# Altium schematic sheet main.SchDoc
size A4
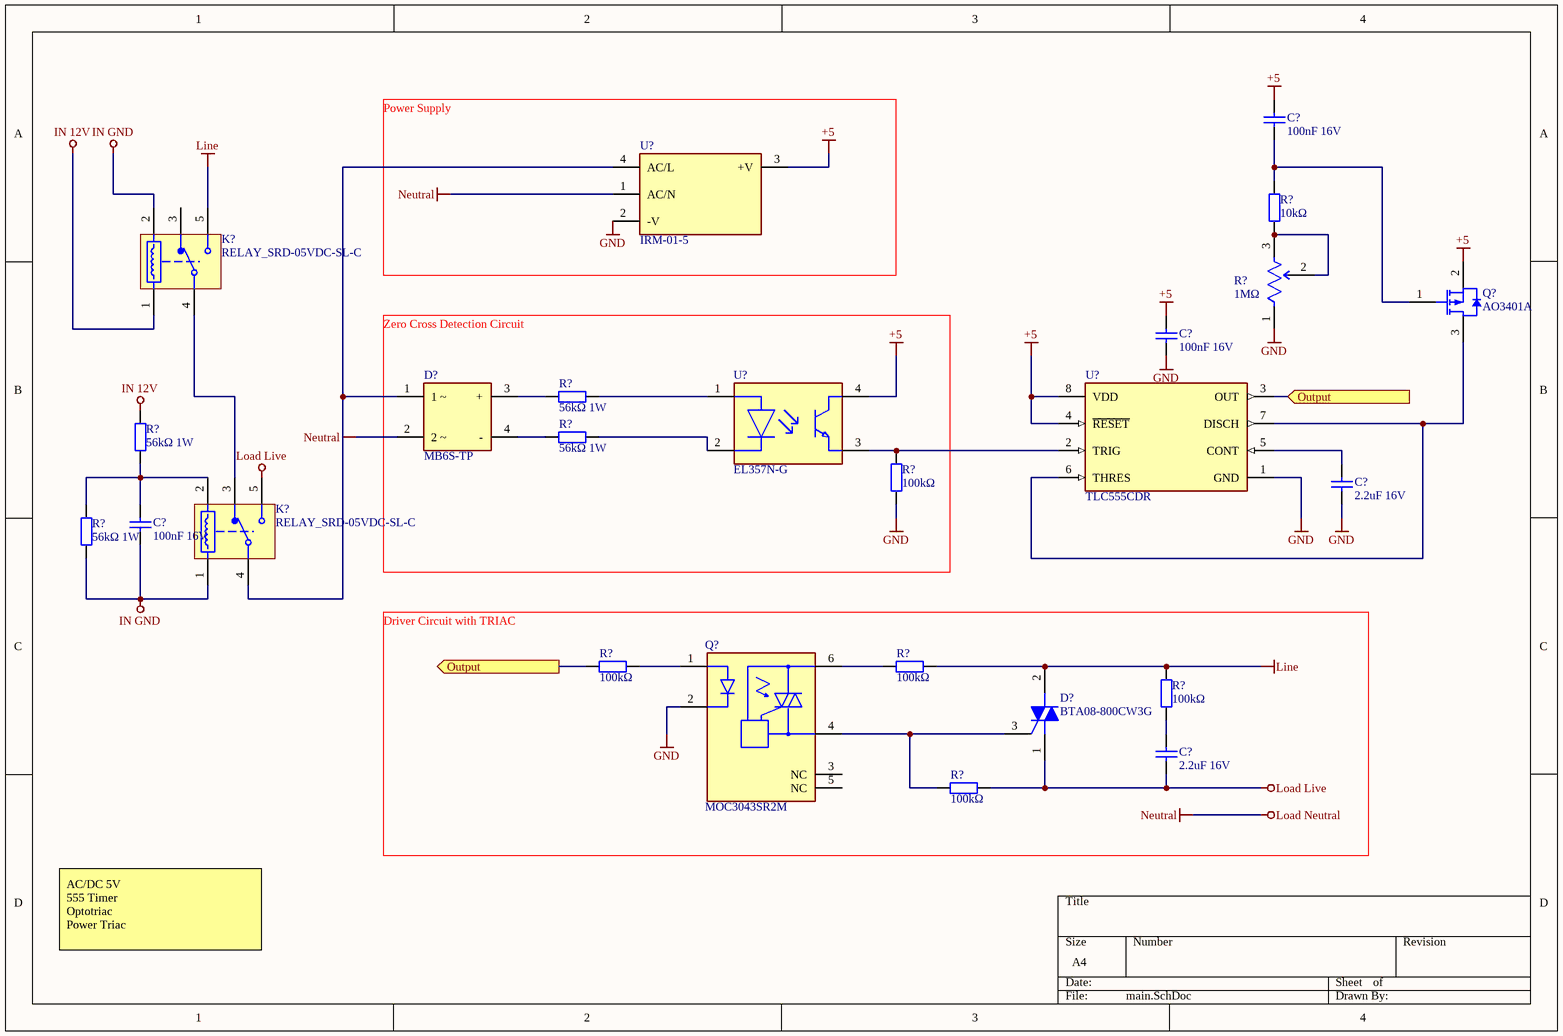
[diagram p0: main.SchDoc]

## Parts
(Parts that share a designator on the sheet are numbered #1, #2 ... from top to bottom, then left to right.)
C?#1  100nF 16V  [CAP_0805]
C?#2  100nF 16V  [CAP_0805]
C?#3  2.2uF 16V  [CAP_0805]
C?#4  100nF 16V  [CAP_0805]
C?#5  2.2uF 16V  [CAP_0805]
D?#1  MB6S-TP  [FP-MBS-1-MFG]
D?#2  BTA08-800CW3G  [ONSC-TO-220-3-221A-07]
K?#1  RELAY_SRD-05VDC-SL-C  [SRD-05-VDC-SL-C]
K?#2  RELAY_SRD-05VDC-SL-C  [SRD-05-VDC-SL-C]
Q?#1  AO3401A  [AO-SOT-23-3L_V]
Q?#2  MOC3043SR2M  [FP-646BY-MFG]
R?#1  10kΩ  [RES_0805]
R?#2  1MΩ  [FP-3386P-MFG]
R?#3  56kΩ 1W  [RES_0805]
R?#4  56kΩ 1W  [RES_0805]
R?#5  56kΩ 1W  [RES_0805]
R?#6  100kΩ  [RES_0805]
R?#7  56kΩ 1W  [RES_0805]
R?#8  100kΩ  [RES_0805]
R?#9  100kΩ  [RES_0805]
R?#10  100kΩ  [RES_0805]
R?#11  100kΩ  [RES_0805]
U?#1  IRM-01-5  [FP-IRM-01-5-MFG]
U?#2  TLC555CDR  [FP-D0008A-IPC_B]
U?#3  EL357N-G  [SOP-4_4mm]

## Ports
Output (in), Output (out)

## Nets
+5: C?#1.2 C?#2.2 Q?#1.2(SOURCE) U?#1.3(+V) U?#2.4(~{RESET}) U?#2.8(VDD) U?#3.4(C)
GND: C?#2.1 C?#3.1 Q?#2.2(C) R?#2.1(CCW) R?#6.1 U?#1.2(-V) U?#2.1(GND)
IN 12V: K?#1.1 R?#5.2
IN GND: C?#4.1 K?#1.2 K?#2.1 R?#7.1
Line: D?#2.2(MT2) K?#1.5(NO) R?#9.1 R?#10.1
Load Live: C?#5.1 D?#2.1(MT1) K?#2.5(NO) R?#11.1
Load Neutral: D?#1.2(2_~) U?#1.1(AC/N)  [also labelled Neutral]
Output: R?#8.2 U?#2.3(OUT) ; port Output
NetC?#1_1: C?#1.1 Q?#1.1(GATE) R?#1.2
NetC?#3_2: C?#3.2 U?#2.5(CONT)
NetC?#4_2: C?#4.2 K?#2.2 R?#5.1 R?#7.2
NetC?#5_2: C?#5.2 R?#10.2
NetD?#1_1: D?#1.1(1_~) K?#2.4(COM) U?#1.4(AC/L)
NetD?#1_3: D?#1.3(+) R?#3.1
NetD?#1_4: D?#1.4(-) R?#4.1
NetD?#2_3: D?#2.3(G) Q?#2.4(1_MAIN_TERM.) R?#11.2
NetK?#1_4: K?#1.4(COM) K?#2.3(NC)
NetQ?#1_3: Q?#1.3(DRAIN) U?#2.6(THRES) U?#2.7(DISCH)
NetQ?#2_1: Q?#2.1(A) R?#8.1
NetQ?#2_6: Q?#2.6(2_MAIN_TERM.) R?#9.2
NetR?#1_1: R?#1.1 R?#2.2(WIPER) R?#2.3(CW)
NetR?#3_2: R?#3.2 U?#3.1(A)
NetR?#4_2: R?#4.2 U?#3.2(C)
NetR?#6_2: R?#6.2 U?#2.2(TRIG) U?#3.3(E)

Not connected (* = marked no-connect by the designer): K?#1 3(NC); Q?#2 3(NC) 5(NC)

## Notes on the sheet
- (near U?#1) Power Supply
- Zero Cross Detection Circuit
- Driver Circuit with TRIAC
- AC/DC 5V
  555 Timer
  Optotriac
  Power Triac

## Library data of the parts
C?#1-C?#5 = CAP_2.2uF_0805: Cap Ceramic 2.2uF 16V X7R 10% Pad SMD 0805 Soft Termination 125C Automotive T/R; Manufacturer: Murata; Manufacturer Part Number: GCJ21BR71C225KA13L; Supplier 1: Mouser; RoHS: Yes; Category: Ceramic Capacitors; Stock 1: 34901; Pricing 1: 1=0.49000, 10=0.34200, 50=0.34200, 100=0.20500, 500=0.15400, 1000=0.13000, 3000=0.12200, 6000=0.11600, 10000=0.11600 (USD); Mount: Surface Mount; Case/Package: 0805; Case Code (Metric): 2012; Case Code (Imperial): 0805; Min Operating Temperature: -55°C; Max Operating Temperature: 125°C; Capacitance: 2.2uF; Tolerance: 10%; Packaging: Tape and Reel; Voltage Rating: 16V; Dielectric: X7R; Voltage Rating (DC): 16V; Package Quantity: 1; Termination: SMD/SMT; Series: GCJ; Construction: Flat; Features: Soft Termination; Length: 2mm; Width: 0.049inch; Height: 1.25mm; Thickness: 0.057inch; Depth: 1.25mm; Ratings: AEC-Q200; Radiation Hardening: No; RoHS Compliant: Yes; Lead Free: Lead Free; ComponentLink1URL: https://datasheet.ciiva.com/172/product-172726.pdf?src-supplier=Digi-Key; ComponentLink1Description: https://datasheet.ciiva.com/172/product-172726.pdf?src-supplier=Digi-Key; ComponentLink2URL: https://datasheet.ciiva.com/172/s0717e-172727.pdf?src-supplier=Digi-Key; ComponentLink2Description: https://datasheet.ciiva.com/172/s0717e-172727.pdf?src-supplier=Digi-Key; ComponentLink3URL: https://datasheet.ciiva.com/172/s0717e-172728.pdf?src-supplier=Digi-Key; ComponentLink3Description: https://datasheet.ciiva.com/172/s0717e-172728.pdf?src-supplier=Digi-Key; Supplier Part Number 1: 81-GCJ21BR71C225KA3L
D?#1 = CMP-56207-000002-1: BRIDGE RECT 1P 600V 500MA MBS-1; Manufacturer: MCC; Value: 13pF; Max Surge Forward Current: 35A; Standoff Height: 0.05mm; Max Junction Temp: +150°C; Forward Current: 0.5A; Peak Reverse Current: 5uA; Temperature: -55°C to +150°C; Temperature Range High: +150°C; Package: MBS-1; Temperature Range Low: -55°C; Octopart: https://octopart.com/mb6s-tp-mcc-733391; Max Repetitive Reverse Voltage: 600V; Mouser Description: Bridge Rectifiers .5A 600V; ComponentLink2URL: https://www.mccsemi.com/pdf/Products/MB05S-MB10S(MBS-1)-H.pdf; Reverse Voltage: 600V; ComponentLink2Description: Datasheet; Height: 2.9mm; Manufacturer Part Number: MB6S-TP; Lead Free: Yes; RoHS: TRUE; Category: Diode; Device Class L2: Diodes; Digikey Description: BRIDGE RECT 1P 600V 500MA MBS-1; Device Class L1: Discrete Semiconductors; Automotive: No; Device Class L3: Rectifier Diodes; Capacitance: 13pF
D?#2 = CMP-1070-00054-1: Triacs, Silicon Bidirectional Thyristor, 3-Pin TO-220, Pb-Free, Tube; Manufacturer: On Semiconductor; ITSM Max (A): 90; IT(RMS) Max (A): 8; IGT Max (mA): 35; ComponentLink2Description: Datasheet; PackageVersion: Rev. O, 07/2008; DatasheetVersion: Rev. 0; ComponentLink1Description: Manufacturer URL; Packing: Tube; PackageDescription: 3-Pin Flange Mount, Vertical Straight Lead, Body 9.97 x 4.445 mm, Pitch 2.54 mm; Mounting Technology: Through Hole; PackageReference: TO-220-3-221A-07; ComponentLink3Description: Package Specification; RoHS: Pb-Free; PartNumber: BTA08-800CW3G; ComponentLink1URL: http://www.onsemi.com/; ComponentLink3URL: http://www.onsemi.com/pub_link/Collateral/221A-07.PDF; ComponentLink2URL: http://www.onsemi.com/pub_link/Collateral/BTA08-800CW3-D.PDF
K?#1 K?#2 = RELAY_SRD-05VDC-SL-C: 5VDC SPDT Relay; Switching power: 240W; Max. AC current: 3A; Max. DC current: 7A; ca: 7A
Q?#1 = CMP-2000-05778-1: P-Channel MOSFET, 30 V, 4 A, -55 to 150 degC, 3-Pin SOT-23-3L, RoHS, Tape and Reel; Manufacturer: Alpha and Omega; Output Power (Max): NotRequiredW; Power Dissipation: 1.4W; Rad Hardened: No; Drain Efficiency: NotRequired%; Drain-Source On-Volt: 30V; Noise Figure: NotRequireddB; Frequency (Max): NotRequiredMHz; Number of  Elements: 1; Gate-Source Voltage (Max): ?12V; Drain Current (Max): 4A; Channel Mode: Enhancement; Drain-Source On-Res: 0.044ohm; Type: PowerMOSFET; Polarity: P; Package URL: http://www.aosmd.com/res/packaging_information/SOT-23-3L.pdf; Datasheet URL: http://www.aosmd.com/res/data_sheets/AO3401A.pdf; Package Type: SOT-23; Package Description: 3-Pin Small Outline Transistor, Body 2.95 x 1.6 mm, Pitch 0.95 mm; Mounting: SurfaceMount; Manufacturer URL: http://www.aosmd.com/; Continuous Drain Current: 4A; Package Reference: SOT-23-3L; Mounting Technology: SurfaceMount; Operating Temperature Classification: Military; Power Gain: NotRequireddB; Datasheet Version: Rev. 3, 03/2011; Operating Temp Range: -55Cto150C; Pin Count: 3
Q?#2 = CMP-07144-000011-2: OPTOISOLATOR 4.17KV TRIAC 6SMD; Forward Voltage: 1.5V; Approvals: UL; Number of Circuits: 1; Output Voltage: 400V; Nominal Input Voltage: 1.25V; Hold Current: 400uA; Forward Current: 60mA; Max Power Dissipation: 250mW; Reverse Breakdown Voltage: 6V; Isolation Voltage: 5.25kV; Radiation Hardening: No; Number of Pins: 6; Max Input Voltage: 1.5V; Case/Package: SMD/SMT; Mount: Surface Mount; REACH SVHC: No SVHC; Number of Channels: 1; Weight: 0.81g; Contact Plating: Tin; Min Operating Temperature: -40°C; Packaging: Tape and Reel; Max Input Current: 60mA; Lead Free: Lead Free; Power Dissipation: 250mW; Input Current: 60mA; Max Operating Temperature: 85°C; Package Quantity: 1; Number of Elements: 1
R?#1 R?#3-R?#11 = RES_100kohm_0805: Res Thick Film 0805 100K Ohm 1% 0.125W(1/8W) ±100ppm/°C Molded SMD Punched Carrier T/R; Manufacturer: Panasonic; Manufacturer Part Number: ERJ-6ENF1003V; Resistance: 100kR; Max Power Dissipation: 125mW; Voltage Rating (DC): 150V; Supplier 1: Mouser; RoHS: Yes; Category: Chip SMD Resistors; Stock 1: 3449; Pricing 1: 1=0.11000, 10=0.08300, 50=0.08300, 100=0.03200, 1000=0.01400, 2500=0.01300, 5000=0.01000, 10000=0.01000 (USD); Mount: Surface Mount; Case/Package: 0805; Number of Pins: 2; Case Code (Metric): 2012; Case Code (Imperial): 0805; Contact Plating: Tin; Min Operating Temperature: -55°C; Max Operating Temperature: 155°C; Tolerance: 1%; Packaging: Tape and Reel; Number of Terminations: 2; Temperature Coefficient: 100ppm/°C; Resistor Type: Thick Film; Features: Automotive AEC-Q200; Power Rating: 125mW; Package Quantity: 1; Voltage Rating: 150V; Termination: SMD/SMT; Length: 2mm; Width: 0.049inch; Height: 0.6mm; Depth: 1.25mm; Radiation Hardening: No; Lead Free: Lead Free; Military Standard: Not; REACH SVHC: No SVHC; ComponentLink1URL: https://datasheet.ciiva.com/11821/0900766b80f80784-11821507.pdf?src-supplier=RSComponents; ComponentLink1Description: https://datasheet.ciiva.com/11821/0900766b80f80784-11821507.pdf?src-supplier=RSComponents; ComponentLink2URL: https://datasheet.ciiva.com/22723/426256-22723909.pdf?src-supplier=Element14; ComponentLink2Description: https://datasheet.ciiva.com/22723/426256-22723909.pdf?src-supplier=Element14; ComponentLink3URL: https://datasheet.ciiva.com/46419/1678782-46419877.pdf?src-supplier=Element14; ComponentLink3Description: https://datasheet.ciiva.com/46419/1678782-46419877.pdf?src-supplier=Element14; ComponentLink4URL: https://datasheet.ciiva.com/27055/1988989-27055734.pdf?src-supplier=Jameco; ComponentLink4Description: https://datasheet.ciiva.com/27055/1988989-27055734.pdf?src-supplier=Jameco; ComponentLink5URL: https://datasheet.ciiva.com/16449/aoa0000ce2-16449480.pdf?src-supplier=Future+Electronics; ComponentLink5Description: https://datasheet.ciiva.com/16449/aoa0000ce2-16449480.pdf?src-supplier=Future+Electronics; ComponentLink6URL: https://datasheet.ciiva.com/17208/aoa0000ce2-17208153.pdf?src-supplier=Avnet+Europe; ComponentLink6Description: https://datasheet.ciiva.com/17208/aoa0000ce2-17208153.pdf?src-supplier=Avnet+Europe; ComponentLink7URL: https://datasheet.ciiva.com/22667/1678782-22667897.pdf?src-supplier=Element14; ComponentLink7Description: https://datasheet.ciiva.com/22667/1678782-22667897.pdf?src-supplier=Element14; ComponentLink8URL: https://datasheet.ciiva.com/24023/aoa0000ce2-24023497.pdf?src-supplier=Mouser; ComponentLink8Description: https://datasheet.ciiva.com/24023/aoa0000ce2-24023497.pdf?src-supplier=Mouser; ComponentLink9URL: https://datasheet.ciiva.com/7830/426256-7830746.pdf?src-supplier=Element14; ComponentLink9Description: https://datasheet.ciiva.com/7830/426256-7830746.pdf?src-supplier=Element14; ComponentLink10URL: https://datasheet.ciiva.com/30257/aoa0000ce2-30257690.pdf?src-supplier=Onlinecomponents.com; ComponentLink10Description: https://datasheet.ciiva.com/30257/aoa0000ce2-30257690.pdf?src-supplier=Onlinecomponents.com; ComponentLink11URL: https://datasheet.ciiva.com/7830/426256-7830988.pdf?src-supplier=Element14; ComponentLink11Description: https://datasheet.ciiva.com/7830/426256-7830988.pdf?src-supplier=Element14; ComponentLink12URL: https://datasheet.ciiva.com/16776/70260748-16776892.pdf?src-supplier=Allied+Electronics; ComponentLink12Description: https://datasheet.ciiva.com/16776/70260748-16776892.pdf?src-supplier=Allied+Electronics; ComponentLink13URL: https://datasheet.ciiva.com/16788/70260748-16788734.pdf?src-supplier=Allied+Electronics; ComponentLink13Description: https://datasheet.ciiva.com/16788/70260748-16788734.pdf?src-supplier=Allied+Electronics; ComponentLink14URL: https://datasheet.ciiva.com/48531/aoa0000ce2-48531486.pdf?src-supplier=Avnet; ComponentLink14Description: https://datasheet.ciiva.com/48531/aoa0000ce2-48531486.pdf?src-supplier=Avnet; Supplier Part Number 1: 667-ERJ-6ENF1003V
R?#2 = CMP-07234-000020-1: TRIMMER 1M OHM 0.5W PC PIN TOP; Manufacturer Part Number: 3386P-1-105TLF; Manufacturer: Bourns Inc.; Tolerance: 10%; Temperature Coefficient: 100ppm/°C; Standoff Height: 0.38mm; ComponentLink2URL: https://www.bourns.com/docs/Product-Datasheets/3386.pdf; Resistance: 1MΩ; Temperature Range High: +125°C; Category: Res; Temperature: -55°C to +125°C; Series: 3386; Temperature Range Low: -55°C; Device Class L3: Variable Resistors and Potentiometers; Value: 1MΩ; Power Rating: 0.5W; Digikey Description: TRIMMER 1M OHM 0.5W PC PIN TOP; Device Class L1: Passive Components; Package: 3386P; Automotive: No; Octopart: https://octopart.com/3386p-1-105tlf-bourns-2025467; Mouser Description: Trimmer Resistors - Through Hole 3/8 1Mohms 10% 0.5Watts Square; Device Class L2: Resistors; Composition: Cermet; ComponentLink2Description: Datasheet; Height: 5.08mm; RoHS: TRUE; Lead Free: Yes
U?#1 = CMP-28435-000004-1: AC/DC CONVERTER 5V 1W; RoHS Compliant: Yes; Lead Free: Lead Free
U?#2 = CMP-04857-000001-1: IC OSC SGL TIMER 2.1MHZ 8-SOIC; Min Supply Voltage: 2V; Number of Channels: 1; Max Power Dissipation: 725mW; Max Supply Voltage: 15V; Low Level Output Current: 100mA; Current Rating: 250A; Quiescent Current: 250uA; Operating Supply Current: 360uA; High Level Output Current: -10mA; Width: 3.91mm; Case/Package: SOIC; Weight: 0.002561oz; Frequency: 2.1MHz; Height: 1.58mm; Package Quantity: 2500; REACH SVHC: No SVHC; Number of Timers/Counters: 1; Lead Free: Lead Free; Number of Pins: 8; Max Operating Temperature: 125°C; Min Operating Temperature: -40°C; Length: 4.9mm; Radiation Hardening: No; Packaging: Tape and Reel; Termination: SMD/SMT; Mount: Surface Mount; Power Dissipation: 725mW
U?#3 = OPTOCOUPLER_EL357N-G: 4 PIN SOP PHOTOTRANSISTOR PHOTOCOUPLER / CTR: 50~600% at IF =5mA, VCE =5V / 4 Pin SOP with a 2.0 mm profile; ComponentLink1Description: Datasheet; ComponentLink1URL: https://www.mouser.com/datasheet/2/143/201407061738295695-365680.pdf